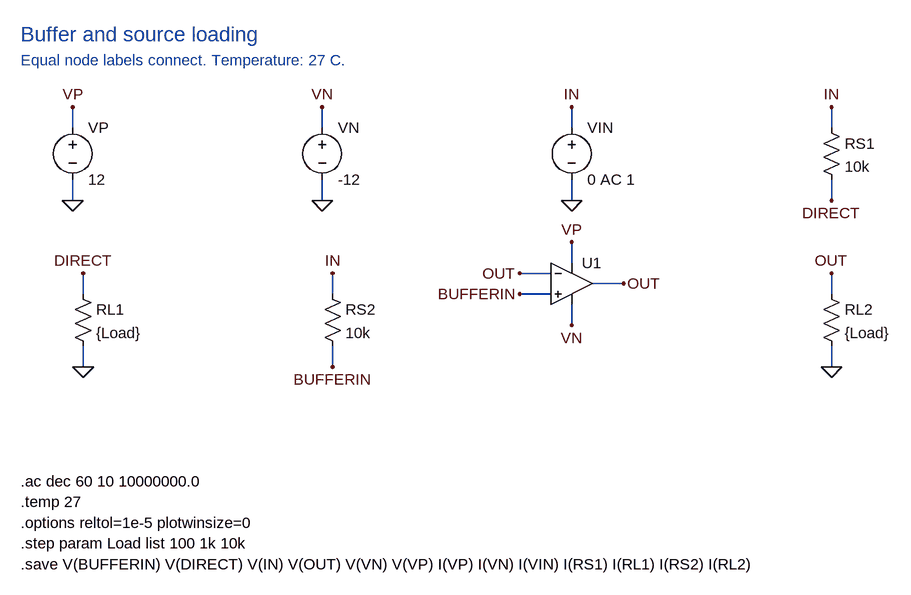
[diagram p0: schematic opamp-buffer-loading.asc]
opamp-buffer-loading.asc, the LTspice schematic file:
Version 4
SHEET 1 1740 1000
WIRE 144 176 144 144
WIRE 144 256 144 288
WIRE 528 176 528 144
WIRE 528 256 528 288
WIRE 912 176 912 144
WIRE 912 256 912 288
WIRE 1312 176 1312 144
WIRE 1312 256 1312 288
WIRE 160 432 160 400
WIRE 160 512 160 544
WIRE 544 432 544 400
WIRE 544 512 544 544
WIRE 880 432 832 432
WIRE 880 400 832 400
WIRE 912 384 912 352
WIRE 912 448 912 480
WIRE 944 416 992 416
WIRE 1312 432 1312 400
WIRE 1312 512 1312 544
FLAG 144 144 VP
FLAG 144 288 0
FLAG 528 144 VN
FLAG 528 288 0
FLAG 912 144 IN
FLAG 912 288 0
FLAG 1312 144 IN
FLAG 1312 288 DIRECT
FLAG 160 400 DIRECT
FLAG 160 544 0
FLAG 544 400 IN
FLAG 544 544 BUFFERIN
FLAG 832 432 BUFFERIN
FLAG 832 400 OUT
FLAG 912 352 VP
FLAG 912 480 VN
FLAG 992 416 OUT
FLAG 1312 400 OUT
FLAG 1312 544 0
SYMBOL voltage 144 160 R0
SYMATTR InstName VP
SYMATTR Value 12
SYMBOL voltage 528 160 R0
SYMATTR InstName VN
SYMATTR Value -12
SYMBOL voltage 912 160 R0
SYMATTR InstName VIN
SYMATTR Value 0 AC 1
SYMBOL res 1296 160 R0
SYMATTR InstName RS1
SYMATTR Value 10k
SYMBOL res 144 416 R0
SYMATTR InstName RL1
SYMATTR Value {Load}
SYMBOL res 528 416 R0
SYMATTR InstName RS2
SYMATTR Value 10k
SYMBOL OpAmps/UniversalOpamp2 912 416 R0
SYMATTR InstName U1
SYMATTR SpiceModel level2
SYMATTR Value2 Avol=1Meg GBW=10Meg Slew=10Meg
SYMATTR SpiceLine Ilimit=100m Rail=0.5 Vos=0
SYMATTR SpiceLine2 En=0 Enk=0 In=0 Ink=0 Rin=1G
SYMBOL res 1296 416 R0
SYMATTR InstName RL2
SYMATTR Value {Load}
TEXT 64 32 Left 3 ;Buffer and source loading
TEXT 64 72 Left 2 ;Equal node labels connect. Temperature: 27 C.
TEXT 64 720 Left 2 !.ac dec 60 10 10000000.0
TEXT 64 752 Left 2 !.temp 27
TEXT 64 784 Left 2 !.options reltol=1e-5 plotwinsize=0
TEXT 64 816 Left 2 !.step param Load list 100 1k 10k
TEXT 64 848 Left 2 !.save V(BUFFERIN) V(DIRECT) V(IN) V(OUT) V(VN) V(VP) I(VP) I(VN) I(VIN) I(RS1) I(RL1) I(RS2) I(RL2)

The netlist it stands for:
* opamp-buffer-loading.asc
VP VP 0 12
VN VN 0 -12
VIN IN 0 0 AC 1
RS1 IN DIRECT 10k
RL1 DIRECT 0 {Load}
RS2 IN BUFFERIN 10k
XU1 BUFFERIN OUT VP VN OUT level2 Avol=1Meg GBW=10Meg Slew=10Meg Ilimit=100m Rail=0.5 Vos=0 En=0 Enk=0 In=0 Ink=0 Rin=1G  ; pins In+ In- V+ V- OUT
RL2 OUT 0 {Load}
* Buffer and source loading
* Equal node labels connect. Temperature: 27 C.
.ac dec 60 10 10000000.0
.temp 27
.options reltol=1e-5 plotwinsize=0
.step param Load list 100 1k 10k
.save V(BUFFERIN) V(DIRECT) V(IN) V(OUT) V(VN) V(VP) I(VP) I(VN) I(VIN) I(RS1) I(RL1) I(RS2) I(RL2)
.lib UniversalOpAmp2.lib
.backanno
.end